# EAGLE design MAX-M8_Breakout (EAGLE 9.6.2)
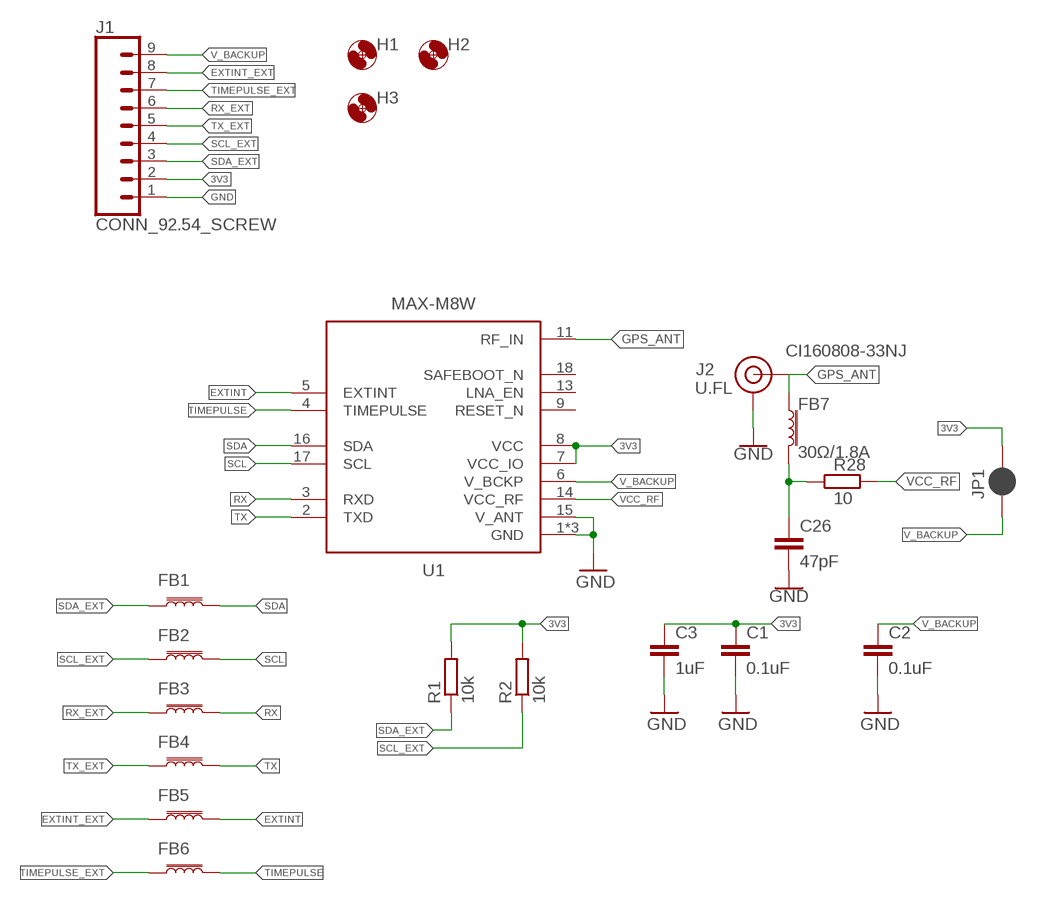
[diagram p0: schematic, sheet 1]

## Parts
C1  0.1uF  C-EU0.1UFC0603  [C0603]
C2  0.1uF  C-EU0.1UFC0603  [C0603]
C3  1uF  C-EU1UFC0603  [C0603]
C26  47pF  C-EUC0402  [C0402]
FB1  FERRITE_BEAD1KS0402  [R0402]
FB2  FERRITE_BEAD1KS0402  [R0402]
FB3  FERRITE_BEAD1KS0402  [R0402]
FB4  FERRITE_BEAD1KS0402  [R0402]
FB5  FERRITE_BEAD1KS0402  [R0402]
FB6  FERRITE_BEAD1KS0402  [R0402]
FB7  30Ω/1.8A  FERRITE_BEAD-0603  [0603]
H1  MOUNTING_HOLE2_NP  [2_56]
H2  MOUNTING_HOLE2_NP  [2_56]
H3  MOUNTING_HOLE2_NP  [2_56]
J1  CONN_92.54_SCREW  [1X09_SCREW]
J2  U.FL  U.FL2PIN  [U.FL]
JP1  JUMPER-SMT_2_NC_PASTE_SILK  [SMT-JUMPER_2_NC_PASTE_SILK]
R1  10k  R-EU_10KR0603  [R0603]
R2  10k  R-EU_10KR0603  [R0603]
R28  10  R-EU_R0402  [R0402]
U1  MAX-M8W  [MAX-M8]

## Nets
3V3: C1.1 C3.1 J1.2 JP1.2 R1.2 R2.2 U1.7(VCC_IO) U1.8(VCC)
ANT_VCC: C26.1 FB7.2 R28.1
EXTINT: FB5.2 U1.5(EXTINT)
EXTINT_EXT: FB5.1 J1.8
GND: C1.2 C2.2 C3.2 C26.2 J1.1 J2.1(GND) J2.2(GND) U1.1(GND) U1.10(GND) U1.12(GND) U1.15(V_ANT)
GPS_ANT: FB7.1 J2.FEED(SIGNAL) U1.11(RF_IN)
RX: FB3.2 U1.3(RXD)
RX_EXT: FB3.1 J1.6
SCL: FB2.2 U1.17(SCL)
SCL_EXT: FB2.1 J1.4 R2.1
SDA: FB1.2 U1.16(SDA)
SDA_EXT: FB1.1 J1.3 R1.1
TIMEPULSE: FB6.2 U1.4(TIMEPULSE)
TIMEPULSE_EXT: FB6.1 J1.7
TX: FB4.2 U1.2(TXD)
TX_EXT: FB4.1 J1.5
V_BACKUP: C2.1 J1.9 JP1.1 U1.6(V_BCKP)
VCC_RF: R28.2 U1.14(VCC_RF)
Unconnected: U1.9(RESET_N) U1.13(LNA_EN) U1.18(SAFEBOOT_N)

## Notes on the sheet
- CI160808-33NJ

## Library data of the parts
C1 C2 = bschulz_passives:C-EU: CAPACITOR, European symbol; DIGIKEY: 490-6051-1-ND; MF: Murata; MPN: GCM188R71E104KA57D
C3 = bschulz_passives:C-EU: CAPACITOR, European symbol; DIGIKEY: 587-1251-1-ND; MF: Yaiyo Yuden; MPN: EMK107BJ105KA-T
C26 = bschulz_passives:C-EU: CAPACITOR, European symbol
FB1-FB6 = bschulz:FERRITE_BEAD: Genaric Ferrite Bead Power Line, 30Ω @ 100MHz 490-1035-1-ND <https://www.digikey.com/product-detail/en/murata-electronics-north-america/BLM18PG300SN1D/490-1035-1-ND/584483> Signal Line, 1kΩ @ 100MHz 490-1024-1-ND <https://www.digikey.com/product-detail/en/murata-electronics-north-america/BLM18BD102SN1D/490-1024-1-ND/584472>; DIGIKEY: 490-4003-1-ND; MF: Murata; MPN: BLM15HD102SN1D
FB7 = SparkFun-Coils:FERRITE_BEAD: Ferrite Bead (blocks, cores, rings, chokes, etc.) Inductor with layers of ferrite used to suppress high frequencies. Often used to isolate high frequency noise. SparkFun Products: IOIO-OTG - V2.2 <https://www.sparkfun.com/products/13613> SparkFun SAMD21 Mini Breakout <https://www.sparkfun.com/products/13664> SparkFun 6 Degrees of Freedom Breakout - LSM6DS3 <https://www.sparkfun.com/products/13339> SparkFun SAMD21 Dev Breakout <https://www.sparkfun.com/products/13672>; DIGIKEY: 445-2986-1-ND; MF: TDK; MPN: MPZ1608D300BTA00; PROD_ID: NDUC-07859
H1-H3 = bschulz:MOUNTING_HOLE: Genaric Mechanical Mounting Hole Hole diameter based on max body diameter + 15% Keepout ring is for diameter of socket cap screw (minimum required clearance) TPlace ring is for diameter of pan head screw (recomended clearance) Specifications: Socket Cap <http://fastener-express.com/fastener-technical/SocketscapSS-Alloy.pdf> Button Head Socket Cap <http://fastener-express.com/fastener-technical/Button-Socket-alloy.pdf> Pan Head <http://fastener-express.com/fastener-technical/pan-machine-Screws.pdf>; DIGIKEY: DNP; MF: N/A; MPN: DNP
J1 = bschulz:CONN_9: Genaric 9 terminal header Digikey 2.54_SCREW <https://www.digikey.com/en/products/detail/te-connectivity-amp-connectors/282834-9/1827298>; DIGIKEY: A122599-ND; MF: TE; MPN: 282834-9
J2 = SparkFun-Connectors:U.FL2PIN: SMD Antenna Connector - U.FL 2mm height, 3.0mm x 3.0mm receptacle size. SparkFun Products: SparkFun WiFi Shield - ESP8266 <https://www.sparkfun.com/products/13287> SparkFun ESP8266 Thing <https://www.sparkfun.com/products/13231> SparkFun MiniGen - Pro Mini Signal Generator Shield <https://www.sparkfun.com/products/11420>; DIGIKEY: WM5587CT-ND; MF: Molex; MPN: 0734120110; PROD_ID: CONN-09193; SF_ID: WRL-09144
JP1 = bschulz:JUMPER-SMT_2_NC_PASTE: Normally closed solder jumper This jumper has an aperture in the stencil to allow solder paste to bridge the split in the wire so it's normally closed (NC). Wick off the solder to open the connection. Reapply solder to reclose the connection.; DIGIKEY: DNP; MF: N/A; MPN: N/A
R1 R2 = bschulz_passives:R-EU_: RESISTOR, European symbol Digikey Parts: Yageo, 0402 <https://www.digikey.com/products/en/resistors/chip-resistor-surface-mount/52?k=&pkeyword=&sv=0&s=4356&sf=1&FV=-1%7C13%2C7%7C2%2C1291%7C39157%2C1989%7C0%2C-8%7C52%2C3%7C1131%2C3%7C2503&quantity=&ColumnSort=0&page=1&stock=1&pageSize=25> Yageo, 0603 <https://www.digikey.com/products/en/resistors/chip-resistor-surface-mount/52?k=&pkeyword=&sv=0&pv1291=39245&sf=1&FV=-5%7C4356%2C-5%7C47360%2C-8%7C52%2C-1%7C13%2C7%7C2%2C1989%7C0&quantity=10&ColumnSort=1000011&page=1&stock=1&pageSize=25> Panasonic, 0603 <https://www.digikey.com/products/en/resistors/chip-resistor-surface-mount/52?k=&pkeyword=&pv252=68&sf=0&FV=ffec373d%2C1c0002%2C142c040c%2C1f140000%2Cffe00034%2C80002%2Cc0001&quantity=&ColumnSort=0&page=1&stock=1&pageSize=25> Panasonic, precision, 0603 <https://www.digikey.com/products/en/resistors/chip-resistor-surface-mount/52?FV=ffec4907%2Cfffc000a%2Cc0172%2C142c040c%2C1f140000%2Cffe00034%2C1c0002&quantity=100&ColumnSort=2085&page=1&stock=1&pageSize=25> Panasonic, 0805 <https://www.digikey.com/products/en/resistors/chip-resistor-surface-mount/52?k=&pkeyword=&pv3=1&sf=0&FV=ffec373d%2C1c0002%2C1f140000%2Cffe00034%2C142c040d&quantity=&ColumnSort=0&page=1&stock=1&pageSize=25> Rohm, current sense <https://www.digikey.com/products/en/resistors/chip-resistor-surface-mount/52?k=&pkeyword=&pv3=1&sf=0&FV=ffecb688%2C1f140000%2Cffe00034%2C1c0002&quantity=&ColumnSort=0&page=1&stock=1&pageSize=25> Vishay, pulse proof automotive <https://www.digikey.com/products/en/resistors/chip-resistor-surface-mount/52?k=&pkeyword=&pv7=2&sf=0&FV=ffec5d6b%2Cffe00034%2C1f140000&quantity=&ColumnSort=0&page=1&stock=1&pageSize=25>; DIGIKEY: 311-10.0KHRCT-ND; MF: Yageo; MPN: RC0603FR-0710KL; VALUE_PART: 10k
R28 = bschulz_passives:R-EU_: RESISTOR, European symbol Digikey Parts: Yageo, 0402 <https://www.digikey.com/products/en/resistors/chip-resistor-surface-mount/52?k=&pkeyword=&sv=0&s=4356&sf=1&FV=-1%7C13%2C7%7C2%2C1291%7C39157%2C1989%7C0%2C-8%7C52%2C3%7C1131%2C3%7C2503&quantity=&ColumnSort=0&page=1&stock=1&pageSize=25> Yageo, 0603 <https://www.digikey.com/products/en/resistors/chip-resistor-surface-mount/52?k=&pkeyword=&sv=0&pv1291=39245&sf=1&FV=-5%7C4356%2C-5%7C47360%2C-8%7C52%2C-1%7C13%2C7%7C2%2C1989%7C0&quantity=10&ColumnSort=1000011&page=1&stock=1&pageSize=25> Panasonic, 0603 <https://www.digikey.com/products/en/resistors/chip-resistor-surface-mount/52?k=&pkeyword=&pv252=68&sf=0&FV=ffec373d%2C1c0002%2C142c040c%2C1f140000%2Cffe00034%2C80002%2Cc0001&quantity=&ColumnSort=0&page=1&stock=1&pageSize=25> Panasonic, precision, 0603 <https://www.digikey.com/products/en/resistors/chip-resistor-surface-mount/52?FV=ffec4907%2Cfffc000a%2Cc0172%2C142c040c%2C1f140000%2Cffe00034%2C1c0002&quantity=100&ColumnSort=2085&page=1&stock=1&pageSize=25> Panasonic, 0805 <https://www.digikey.com/products/en/resistors/chip-resistor-surface-mount/52?k=&pkeyword=&pv3=1&sf=0&FV=ffec373d%2C1c0002%2C1f140000%2Cffe00034%2C142c040d&quantity=&ColumnSort=0&page=1&stock=1&pageSize=25> Rohm, current sense <https://www.digikey.com/products/en/resistors/chip-resistor-surface-mount/52?k=&pkeyword=&pv3=1&sf=0&FV=ffecb688%2C1f140000%2Cffe00034%2C1c0002&quantity=&ColumnSort=0&page=1&stock=1&pageSize=25> Vishay, pulse proof automotive <https://www.digikey.com/products/en/resistors/chip-resistor-surface-mount/52?k=&pkeyword=&pv7=2&sf=0&FV=ffec5d6b%2Cffe00034%2C1f140000&quantity=&ColumnSort=0&page=1&stock=1&pageSize=25>; MF: Yageo
U1 = bschulz:MAX-M8*: MAX-M8* GPS Unit - GNSS Module Characteristics: VCC: 2.7~3.6V Operating Temperature: -40°C to 85°C Digikey: 672-MAX-M8W-0CT-ND (MAX-M8W) <https://www.digikey.com/en/products/detail/MAX-M8W-0/672-MAX-M8W-0CT-ND/6150667?itemSeq=371005764>; DIGIKEY: 672-MAX-M8W-0CT-ND; DISP: MAX-M8W; MF: U-Blox; MPN: MAX-M8W-0

## Board
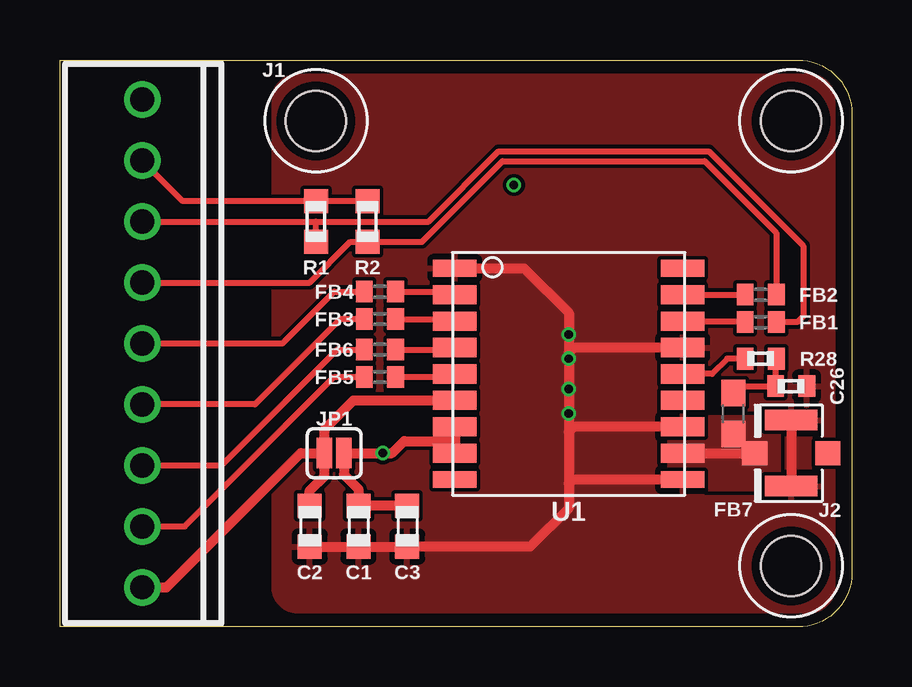
[diagram p1: board, top side]
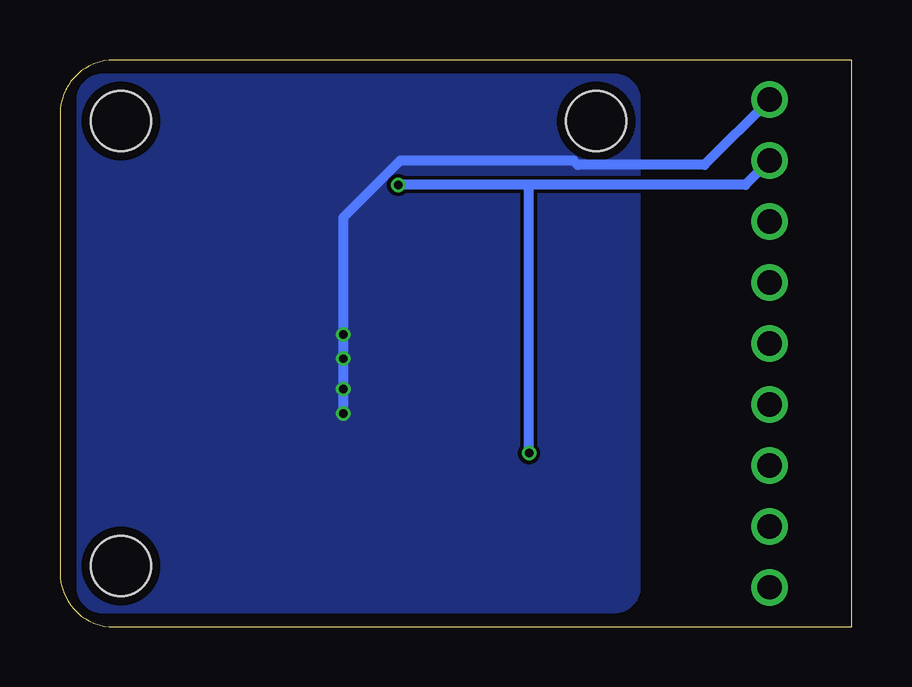
[diagram p2: board, bottom side, seen from below]

Size 33.02 x 23.62 mm. Coordinates in mm from the lower left corner, seen from the top.
Outline: 0,0 0,23.62 30.77,23.62 arc-90 33.02,21.37 33.02,2.25 arc-90 30.77,0 0,0
Copper layers (1*16): Top 0.035559375mm / dielectric 1.6mm / Bottom 0.035559375mm
Design rules "oshpark-2layer": minimum track width 6mil, minimum drill 10mil, track to track 6mil, track to pad 6mil, pad to pad 6mil, via to via 6mil, smd to smd 6mil, copper to edge 15mil, drill to drill 6mil, minimum pad ring 5mil, minimum via ring 5mil, stop-mask expansion 2.5mil, vias tented up to drill 0mil, thermal gap 10mil

### Footprints (pad centres in the part's own frame; a part is rotated, then mirrored left to right if it is on the bottom)
C0603 = smd 1 x 1: 1 -0.85,0; 2 0.85,0
C0402 = smd 0.7 x 0.9: 1 -0.65,0; 2 0.65,0
R0402 = smd 0.7 x 0.9: 1 -0.65,0; 2 0.65,0
0603 = smd 1.1 x 1: 1 -0.85,0; 2 0.85,0
2_56 = hole 2.5: 0,0
1X09_SCREW = drill 1.016: 1 -10.16,0; 2 -7.62,0; 3 -5.08,0; 4 -2.54,0; 5 0,0; 6 2.54,0; 7 5.08,0; 8 7.62,0; 9 10.16,0
U.FL = smd 2.2 x 0.85: 1 0,1.375; 2 0,-1.375 | smd 1.05 x 1: FEED 1.525,0; NC -1.525,0
SMT-JUMPER_2_NC_PASTE_SILK = smd 0.635 x 1.27: 1 -0.406,0; 2 0.406,0
R0603 = smd 1 x 1: 1 -0.85,0; 2 0.85,0
MAX-M8 = smd 1.8 x 0.7: 1 -4.75,4.4; 9 -4.75,-4.4; 10 4.75,-4.4; 18 4.75,4.4 | smd 1.8 x 0.8: 2 -4.75,3.3; 3 -4.75,2.2; 4 -4.75,1.1; 5 -4.75,0; 6 -4.75,-1.1; 7 -4.75,-2.2; 8 -4.75,-3.3; 11 4.75,-3.3; 12 4.75,-2.2; 13 4.75,-1.1; 14 4.75,0; 15 4.75,1.1; 16 4.75,2.2; 17 4.75,3.3

### Placement (x,y rotation side)
C1  12.45,4.19 270 top
C2  10.41,4.19 270 top
C3  14.48,4.19 270 top
C26  30.48,10.03 0 top
FB1  29.21,12.7 180 top
FB2  29.21,13.84 180 top
FB3  13.34,12.83 0 top
FB4  13.34,13.97 0 top
FB5  13.34,10.41 0 top
FB6  13.34,11.56 0 top
FB7  28.07,8.89 90 top
H1  10.67,21.08 0 top
H2  30.48,2.54 0 top
H3  30.48,21.08 0 top
J1  3.43,11.81 270 top
J2  30.48,7.24 180 top
JP1  11.43,7.24 0 top
R1  10.67,16.89 90 top
R2  12.83,16.89 90 top
R28  29.21,11.18 180 top
U1  21.21,10.54 0 top

### Tracks (layer width: path | path; a pad name or v marks a point on that pad's centre or on a via)
3V3  (via drill 0.35)
  Top 0.254: R2.2 R1.2 5.12,17.74 J1.2
  Top 0.406: C3.1 C1.1 12.45,5.74 11.84,6.35 JP1.2 v13.46,7.24 13.84,7.24 14.35,7.75 16.46,7.75 | U1.7 16.46,7.75 | 16.46,7.75 U1.8
  Bottom 0.406: J1.2 4.45,18.41 13.59,18.41 | 13.59,18.41 v18.92,18.41 | v13.46,7.24 13.46,18.29 13.59,18.41
ANT_VCC
  Top 0.254: FB7.2 28.36,10.03 C26.1 29.83,11.15 R28.1
EXTINT
  Top 0.254: FB5.2 16.33,10.41 U1.5
EXTINT_EXT
  Top 0.254: J1.8 5.21,4.19 11.43,10.41 FB5.1
GND  (via drill 0.35)
  Top 0.254: v21.21,8.89 21.21,10.03 | v21.21,9.91 v21.21,11.18 v21.21,12.19 | 26.17,8.13 arc-90 U1.12
  Top 0.406: C2.2 C1.2 C3.2 19.6,3.34 21.21,4.95 21.21,5.97 | U1.1 19.35,14.94 21.21,13.08 v21.21,12.19 21.21,11.43 | 21.21,11.43 v21.21,11.18 21.21,10.03 21.21,8.13 | 21.21,8.13 21.21,5.97 | U1.10 21.38,6.14 21.21,5.97 | U1.12 21.42,8.34 21.21,8.13 | U1.15 21.42,11.64 21.21,11.43 | J2.2 J2.1
  Bottom 0.406: J1.1 6.15,19.25 11.43,19.25 11.61,19.43 18.84,19.43 21.21,17.06 v21.21,8.89
  pour Top (rank 2): 32.26,21.99 32.26,1.64 arc-90 31.26,0.64 9.89,0.64 arc-90 8.89,1.64 8.89,21.99 arc-90 9.89,22.99 31.26,22.99 arc-90
  pour Bottom: 32.26,21.99 32.26,1.64 arc-90 31.26,0.64 9.89,0.64 arc-90 8.89,1.64 8.89,21.99 arc-90 9.89,22.99 31.26,22.99 arc-90
GPS_ANT
  Top 0.406: U1.11 J2.FEED
  pour Top (no thermals): 25.53,6.34 25.53,8.14 arc-90 26.03,8.64 29.34,8.64 arc-90 29.84,8.14 29.84,6.34 arc-90 29.34,5.84 26.03,5.84 arc-90
RX
  Top 0.254: FB3.2 16.37,12.83 U1.3
RX_EXT
  Top 0.254: FB3.1 11.68,12.83 8.13,9.27 J1.6
SCL
  Top 0.254: U1.17 FB2.2
SCL_EXT
  Top 0.254: FB2.1 29.86,16.43 26.88,19.41 18.46,19.41 15.09,16.04 R2.1 12.1,16.04 10.41,14.35 J1.4
SDA
  Top 0.254: U1.16 28.52,12.74 FB1.2
SDA_EXT
  Top 0.254: J1.3 10.67,16.89 | 10.67,16.89 15.37,16.89 18.29,19.81 27.05,19.81 30.99,15.88 30.99,12.95 30.73,12.7 FB1.1 | R1.1 10.67,16.89
TIMEPULSE
  Top 0.254: FB6.2 16.38,11.56 U1.4
TIMEPULSE_EXT
  Top 0.254: J1.7 6.73,6.73 11.56,11.56 FB6.1
TX
  Top 0.254: FB4.2 16.33,13.97 U1.2
TX_EXT
  Top 0.254: J1.5 9.27,11.81 11.43,13.97 FB4.1
V_BACKUP
  Top 0.406: J1.9 4.45,1.65 10.03,7.24 JP1.1 | C2.1 10.41,5.68 11.02,6.29 JP1.1 | JP1.1 11.02,8.23 12.23,9.44 U1.6
VCC_RF
  Top 0.254: R28.2 27.81,11.18 27.18,10.54 U1.14

### Text on the board
tDocu: GND | MAX-M8 Breakout / v0.0 / B. Schulz | 3v3 | SDA | SCL | TX | RX | TP | INT | VBKP | Break44